# EAGLE design pokey-synth (EAGLE 6.6.0)
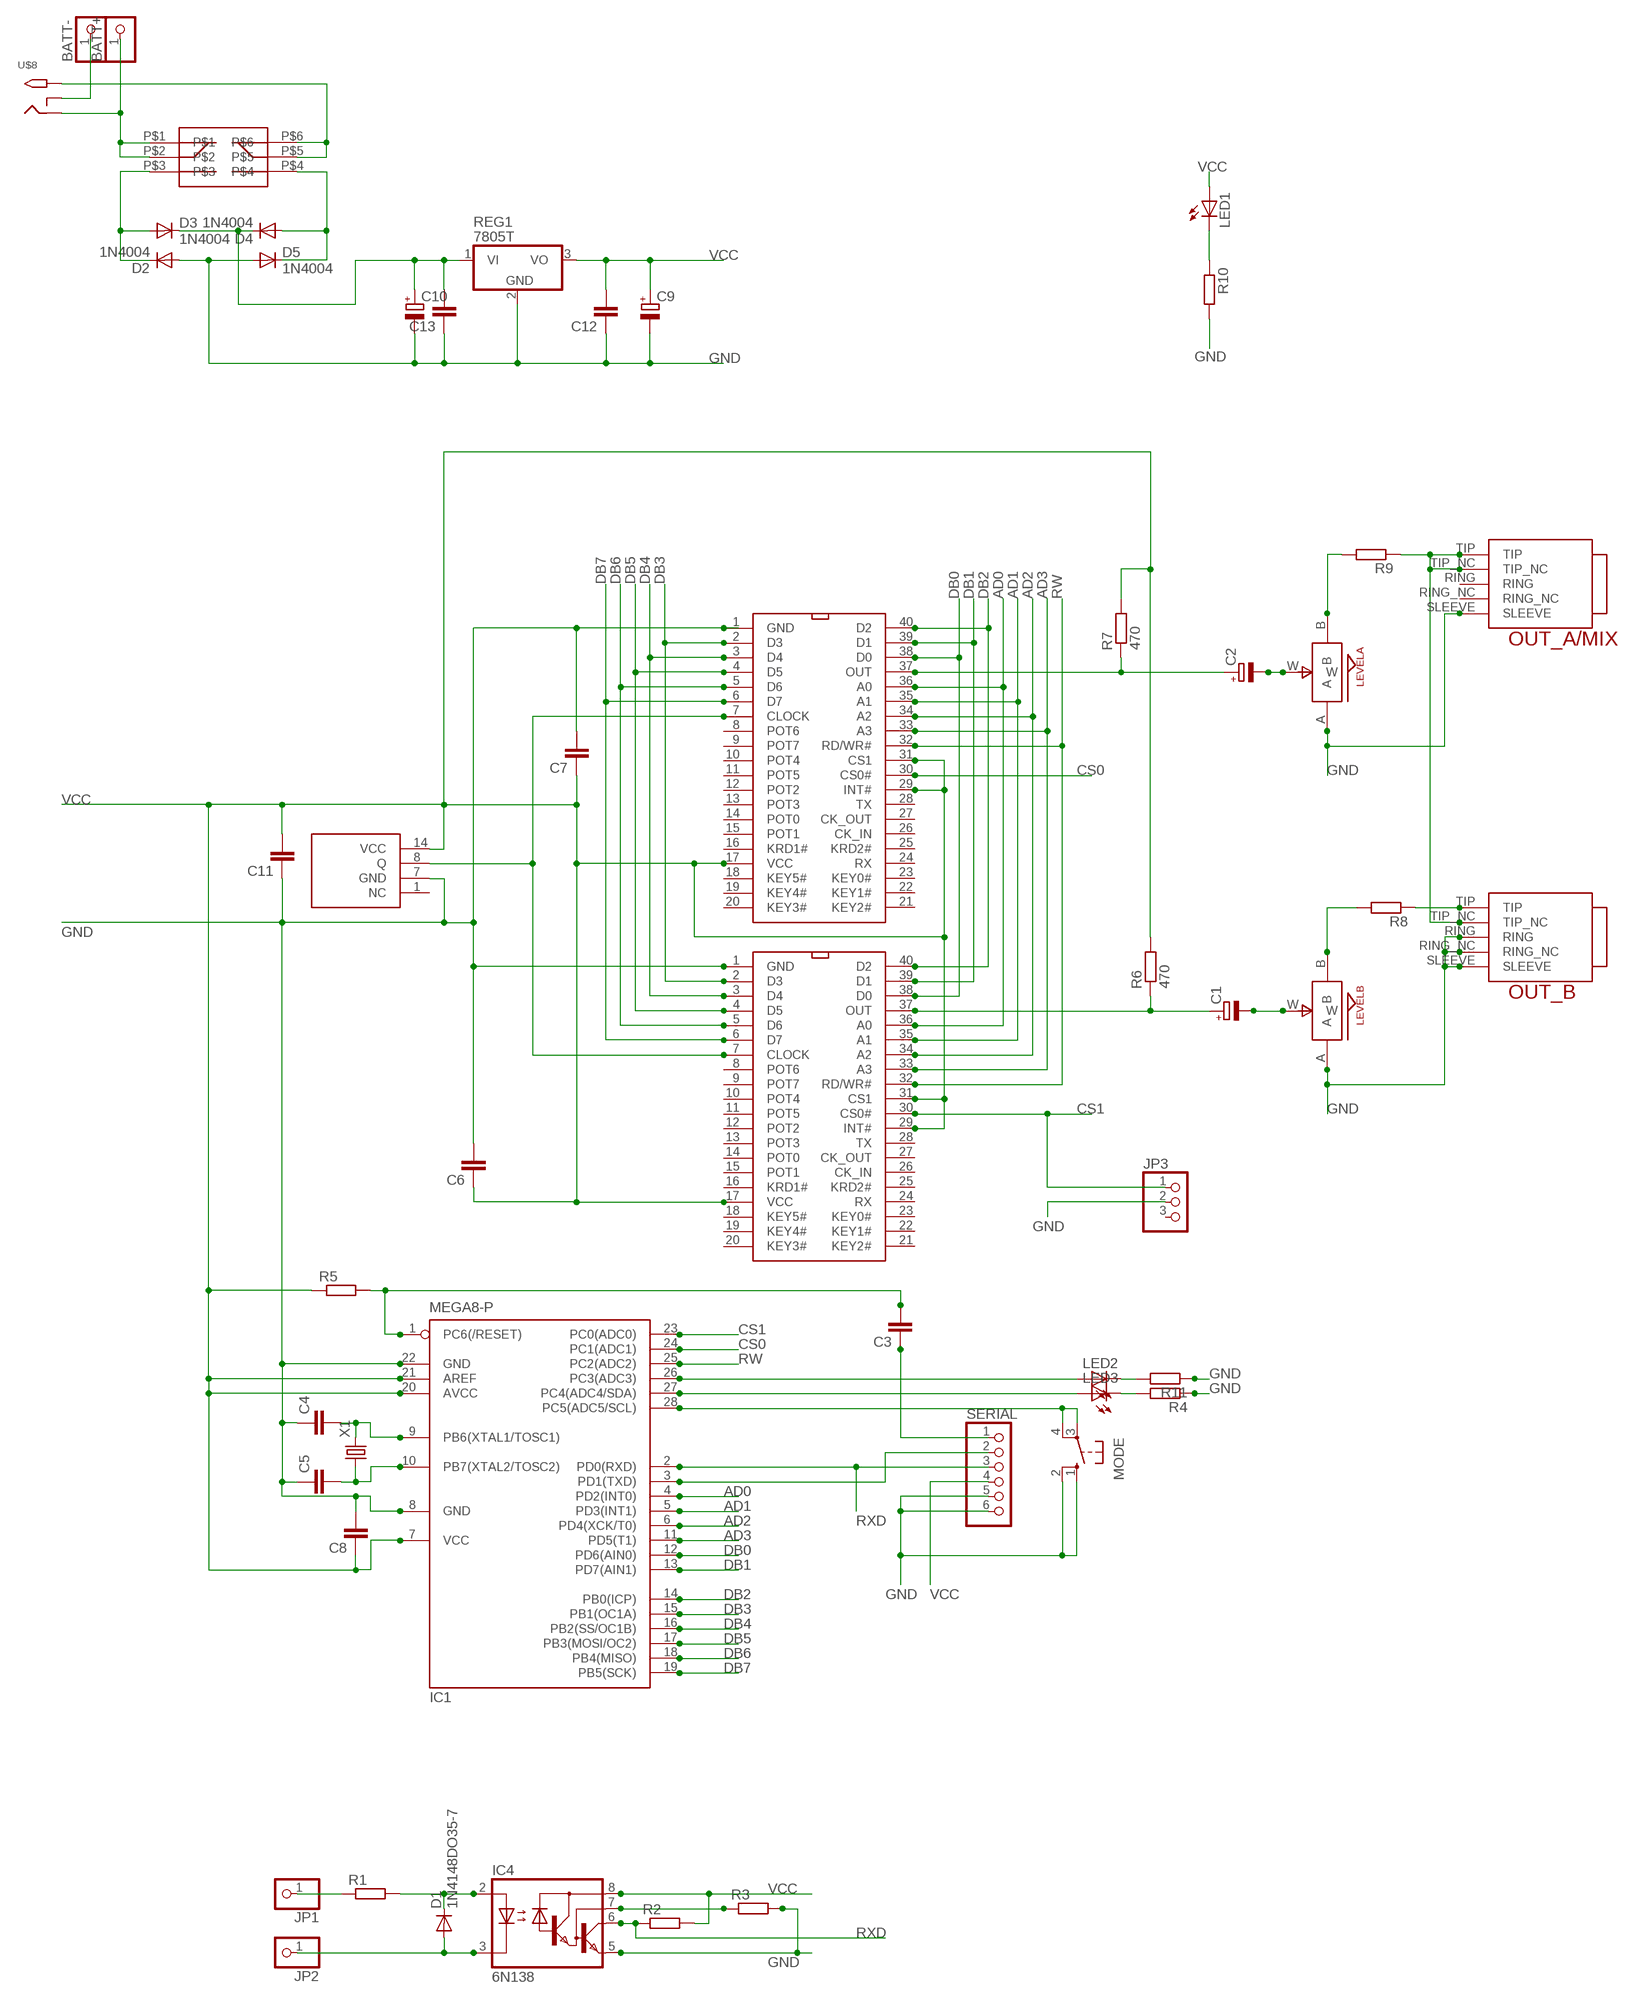
[diagram p0: schematic, sheet 1]

## Parts
BATT+  PINHD-1X1  [1X01]
BATT-  PINHD-1X1  [1X01]
C1  CPOL-EUE2-5  [E2-5]
C2  CPOL-EUE2-5  [E2-5]
C3  C-EU025-024X044  [C025-024X044]
C4  C-EU025-024X044  [C025-024X044]
C5  C-EU025-024X044  [C025-024X044]
C6  C-EU025-024X044  [C025-024X044]
C7  C-EU025-024X044  [C025-024X044]
C8  C-EU025-024X044  [C025-024X044]
C9  CPOL-EUE2-5  [E2-5]
C10  CPOL-EUE2-5  [E2-5]
C11  C-EU025-024X044  [C025-024X044]
C12  C-EU025-024X044  [C025-024X044]
C13  C-EU025-024X044  [C025-024X044]
D1  1N4148DO35-7  [DO35-7]
D2  1N4004  [DO-VERT]
D3  1N4004  [DO-VERT]
D4  1N4004  [DO-VERT]
D5  1N4004  [DO-VERT]
IC1  MEGA8-P  [DIL28-3]
IC2  POKEYDIP40  [DIL40]
IC3  POKEYDIP40  [DIL40]
IC4  6N138  [DIL08]
JP1  PINHD-1X1  [1X01]
JP2  PINHD-1X1  [1X01]
JP3  PINHD-1X3  [1X03]
LED1  LED3MM  [LED3MM]
LED2  LED3MM  [LED3MM]
LED3  LED3MM  [LED3MM]
LEVELA  ALPS_POT_SMALL  [SMALL_ALPS_POT]
LEVELB  ALPS_POT_SMALL  [SMALL_ALPS_POT]
MODE  10-XX  [B3F-10XX]
OSC1  TTLOSC  [TTLOSC]
OUT_A/MIX  TRUCONNECTJACK  [TRUCONNECTJACK]
OUT_B  TRUCONNECTJACK  [TRUCONNECTJACK]
R1  R-EU_0207/7  [0207/7]
R2  R-EU_0207/7  [0207/7]
R3  R-EU_0207/7  [0207/7]
R4  R-EU_0207/7  [0207/7]
R5  R-EU_0207/7  [0207/7]
R6  470  R-EU_0207/7  [0207/7]
R7  470  R-EU_0207/7  [0207/7]
R8  R-EU_0207/7  [0207/7]
R9  R-EU_0207/7  [0207/7]
R10  R-EU_0207/7  [0207/7]
R11  R-EU_0207/7  [0207/7]
REG1  7805T  [TO220H]
SERIAL  HEADER-1X6  [1X06_OVAL]
U$8  2.1MMJACKTHM  [PJ-102A]
U$9  2P2T_LATCHING  [2P2T_LATCHING]
X1  CRYSTALHC49U-V  [HC49U-V]

## Nets
AD0: IC1.4(PD2(INT0)) IC2.36(A0) IC3.36(A0)
AD1: IC1.5(PD3(INT1)) IC2.35(A1) IC3.35(A1)
AD2: IC1.6(PD4(XCK/T0)) IC2.34(A2) IC3.34(A2)
AD3: IC1.11(PD5(T1)) IC2.33(A3) IC3.33(A3)
CS0: IC1.24(PC1(ADC1)) IC2.30(CS0#)
CS1: IC1.23(PC0(ADC0)) IC3.30(CS0#) JP3.1
DB0: IC1.12(PD6(AIN0)) IC2.38(D0) IC3.38(D0)
DB1: IC1.13(PD7(AIN1)) IC2.39(D1) IC3.39(D1)
DB2: IC1.14(PB0(ICP)) IC2.40(D2) IC3.40(D2)
DB3: IC1.15(PB1(OC1A)) IC2.2(D3) IC3.2(D3)
DB4: IC1.16(PB2(SS/OC1B)) IC2.3(D4) IC3.3(D4)
DB5: IC1.17(PB3(MOSI/OC2)) IC2.4(D5) IC3.4(D5)
DB6: IC1.18(PB4(MISO)) IC2.5(D6) IC3.5(D6)
DB7: IC1.19(PB5(SCK)) IC2.6(D7) IC3.6(D7)
GND: C4.1 C5.1 C6.2 C7.2 C8.2 C9.- C10.- C11.1 C12.1 C13.1 D2.A D5.A IC1.8(GND) IC1.22(GND) IC2.1(GND) IC3.1(GND) IC4.5(GND) JP3.2 LEVELA.A LEVELB.A MODE.1(S) MODE.2(S1) OSC1.7(GND) OUT_A/MIX.SLEEVE OUT_B.RING OUT_B.RING_NC OUT_B.SLEEVE R3.2 R4.1 R10.2 R11.1 REG1.2(GND) SERIAL.5 SERIAL.6
N$1: C4.2 IC1.9(PB6(XTAL1/TOSC1)) X1.2
N$2: C5.2 IC1.10(PB7(XTAL2/TOSC2)) X1.1
N$3: C2.- LEVELA.W
N$4: LEVELA.B R9.2
N$5: OUT_A/MIX.TIP OUT_A/MIX.TIP_NC OUT_B.TIP_NC R9.1
N$7: C1.- LEVELB.W
N$8: JP1.1 R1.1
N$9: LEVELB.B R8.2
N$10: OUT_B.TIP R8.1
N$11: IC2.7(CLOCK) IC3.7(CLOCK) OSC1.8(Q)
N$12: C2.+ IC2.37(OUT) R7.1
N$13: C1.+ IC3.37(OUT) R6.1
N$14: D1.C IC4.2(A) R1.2
N$15: D1.A IC4.3(C) JP2.1
N$16: BATT+.1 U$8.RING U$9.P$1 U$9.P$2
N$17: IC4.7(VB) R3.1
N$18: U$8.TIP U$9.P$5 U$9.P$6
N$19: C3.2 IC1.1(PC6(/RESET)) R5.2
N$20: BATT-.1 U$8.RING_SW
N$21: C3.1 SERIAL.1
N$22: D2.C D3.A U$9.P$3
N$23: D4.A D5.C U$9.P$4
N$24: C10.+ C13.2 D3.C D4.C REG1.1(VI)
N$25: LED1.K(C) R10.1
N$26: IC1.26(PC3(ADC3)) LED2.A
N$27: LED2.K(C) R11.2
N$28: IC1.28(PC5(ADC5/SCL)) MODE.3(P) MODE.4(P1)
N$29: IC1.27(PC4(ADC4/SDA)) LED3.A
N$30: LED3.K(C) R4.2
RW: IC1.25(PC2(ADC2)) IC2.32(RD/WR#) IC3.32(RD/WR#)
RXD: IC1.2(PD0(RXD)) IC4.6(VO) R2.1 SERIAL.3
TXD: IC1.3(PD1(TXD)) SERIAL.2
VCC: C6.1 C7.1 C8.1 C9.+ C11.2 C12.2 IC1.7(VCC) IC1.20(AVCC) IC1.21(AREF) IC2.17(VCC) IC2.29(INT#) IC2.31(CS1) IC3.17(VCC) IC3.29(INT#) IC3.31(CS1) IC4.8(VCC) LED1.A OSC1.14(VCC) R2.2 R5.1 R6.2 R7.2 REG1.3(VO) SERIAL.4
Unconnected: IC2.8(POT6) IC2.9(POT7) IC2.10(POT4) IC2.11(POT5) IC2.12(POT2) IC2.13(POT3) IC2.14(POT0) IC2.15(POT1) IC2.16(KRD1#) IC2.18(KEY5#) IC2.19(KEY4#) IC2.20(KEY3#) IC2.21(KEY2#) IC2.22(KEY1#) IC2.23(KEY0#) IC2.24(RX) IC2.25(KRD2#) IC2.26(CK_IN) IC2.27(CK_OUT) IC2.28(TX) IC3.8(POT6) IC3.9(POT7) IC3.10(POT4) IC3.11(POT5) IC3.12(POT2) IC3.13(POT3) IC3.14(POT0) IC3.15(POT1) IC3.16(KRD1#) IC3.18(KEY5#) IC3.19(KEY4#) IC3.20(KEY3#) IC3.21(KEY2#) IC3.22(KEY1#) IC3.23(KEY0#) IC3.24(RX) IC3.25(KRD2#) IC3.26(CK_IN) IC3.27(CK_OUT) IC3.28(TX) JP3.3 OSC1.1(NC) OUT_A/MIX.RING OUT_A/MIX.RING_NC

## Library data of the parts
BATT+ BATT- JP1 JP2 = pinhead:PINHD-1X1: PIN HEADER
C1 C2 C9 C10 = rcl:CPOL-EU: POLARIZED CAPACITOR, European symbol
C3-C8 C11-C13 = rcl:C-EU: CAPACITOR, European symbol
D1 = diode:1N4148: DIODE high speed (Philips)
D2-D5 = jasons_stuff:1N4004: DIODE general purpose rectifier, 1 A
IC1 = atmel:MEGA8-P: MICROCONTROLLER 8 Kbytes FLASH, 1 kbytes SRAM, 512 bytes EEPROM, USART, 4-channel 10 bit ADC, 2-channel 8 bit ADC Pin compatible with Atmega48, ATMega88, ATMega168 Source: avr.lbr; OC_FARNELL: unknown; OC_NEWARK: unknown
IC2 IC3 = jasons_stuff:POKEY
IC4 = optocoupler:6N138: MOTOROLA OPTO COUPLER; MF: VISHAY/TELEFUNKEN; MPN: 6N138; OC_FARNELL: 9860150; OC_NEWARK: 35K5294
JP3 = pinhead:PINHD-1X3: PIN HEADER
LED1-LED3 = led:LED: LED OSRAM: - CHIPLED LG R971, LG N971, LY N971, LG Q971, LY Q971, LO R971, LY R971 LH N974, LH R974 LS Q976, LO Q976, LY Q976 LO Q996 - Hyper CHIPLED LW Q18S LB Q993, LB Q99A, LB R99A - SideLED LS A670, LO A670, LY A670, LG A670, LP A670 LB A673, LV A673, LT A673, LW A673 LH A674 LY A675 LS A676, LA A676, LO A676, LY A676, LW A676 LS A679, LY A679, LG A679 - Hyper Micro SIDELED® LS Y876, LA Y876, LO Y876, LY Y876 LT Y87S - SmartLED LW L88C, LW L88S LB L89C, LB L89S, LG L890 LS L89K, LO L89K, LY L89K LS L896, LA L896, LO L896, LY L896 - TOPLED LS T670, LO T670, LY T670, LG T670, LP T670 LSG T670, LSP T670, LSY T670, LOP T670, LYG T670 LG T671, LOG T671, LSG T671 LB T673, LV T673, LT T673, LW T673 LH T674 LS T676, LA T676, LO T676, LY T676, LB T676, LH T676, LSB T676, LW T676 LB T67C, LV T67C, LT T67C, LS T67K, LO T67K, LY T67K, LW E67C LS E67B, LA E67B, LO E67B, LY E67B, LB E67C, LV E67C, LT E67C LW T67C LS T679, LY T679, LG T679 LS T770, LO T770, LY T770, LG T770, LP T770 LB T773, LV T773, LT T773, LW T773 LH T774 LS E675, LA E675, LY E675, LS T675 LS T776, LA T776, LO T776, LY T776, LB T776 LHGB T686 LT T68C, LB T68C - Hyper Mini TOPLED® LB M676 - Mini TOPLED Santana® LG M470 LS M47K, LO M47K, LY M47K Source: http://www.osram.convergy.de LUXEON: - LUMILED® LXK2-PW12-R00, LXK2-PW12-S00, LXK2-PW14-U00, LXK2-PW14-V00 LXK2-PM12-R00, LXK2-PM12-S00, LXK2-PM14-U00 LXK2-PE12-Q00, LXK2-PE12-R00, LXK2-PE12-S00, LXK2-PE14-T00, LXK2-PE14-U00 LXK2-PB12-K00, LXK2-PB12-L00, LXK2-PB12-M00, LXK2-PB14-N00, LXK2-PB14-P00, LXK2-PB14-Q00 LXK2-PR12-L00, LXK2-PR12-M00, LXK2-PR14-Q00, LXK2-PR14-R00 LXK2-PD12-Q00, LXK2-PD12-R00, LXK2-PD12-S00 LXK2-PH12-R00, LXK2-PH12-S00 LXK2-PL12-P00, LXK2-PL12-Q00, LXK2-PL12-R00 Source: www.luxeon.com KINGBRIGHT: KA-3528ASYC Source: www.kingbright.com
LEVELA LEVELB = jasons_stuff:ALPS_POT_SMALL
MODE = switch-omron:10-XX: OMRON SWITCH; MPN: B3F-1000; OC_FARNELL: 176432; OC_NEWARK: 36M3542
OSC1 = jason_eagle6:TTLOSC
OUT_A/MIX OUT_B = jason_eagle6:TRUCONNECTJACK
R1-R11 = rcl:R-EU_: RESISTOR, European symbol
REG1 = linear:78*: Positive VOLTAGE REGULATOR Source: http://cache.national.com/ds/LM/LM78L05.pdf http://www.fairchildsemi.com/ds/LM/LM7805.pdf
SERIAL = microbuilder:HEADER-1X6: PIN HEADER
U$8 = adafruit:2.1MMJACK: 2.1mm x 5.5mm THM DC jack with internal switch. Digikey part #PJ-102A, 4UCON part #05537 2.1mm x 5.5mm SMT DC jack with internal switch. Digikey part #PJ-002A-SMT, 4UCON part #03267 By microbuilder.eu & adafruit.com
U$9 = jasons_stuff:2P2T_LATCHING
X1 = crystal:CRYSTAL: CRYSTAL; OC_FARNELL: 1666969; OC_NEWARK: unknown

## Board
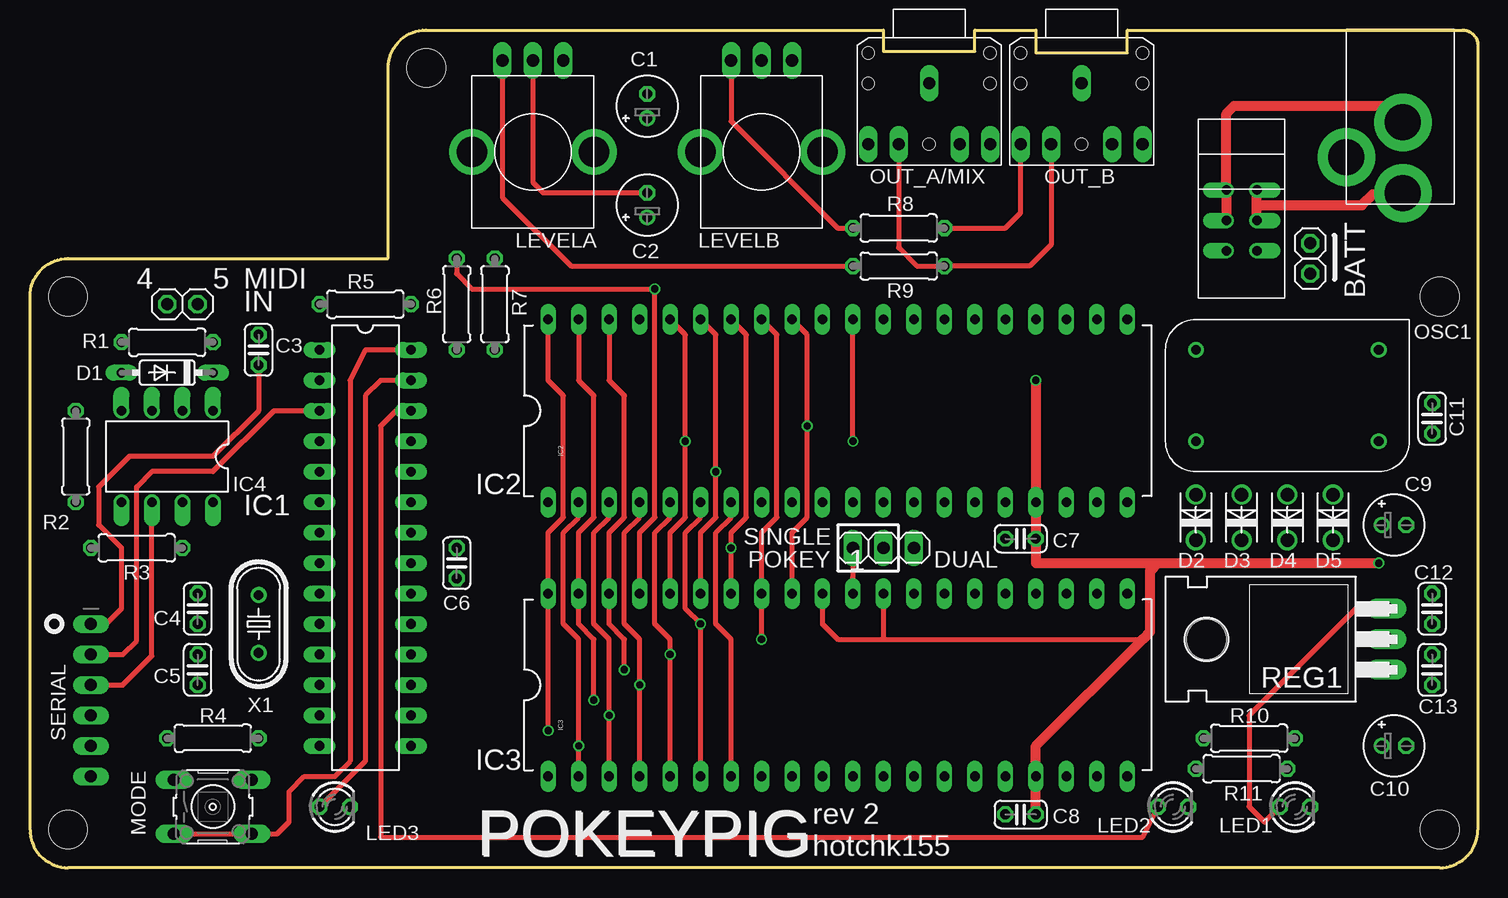
[diagram p1: board, top side]
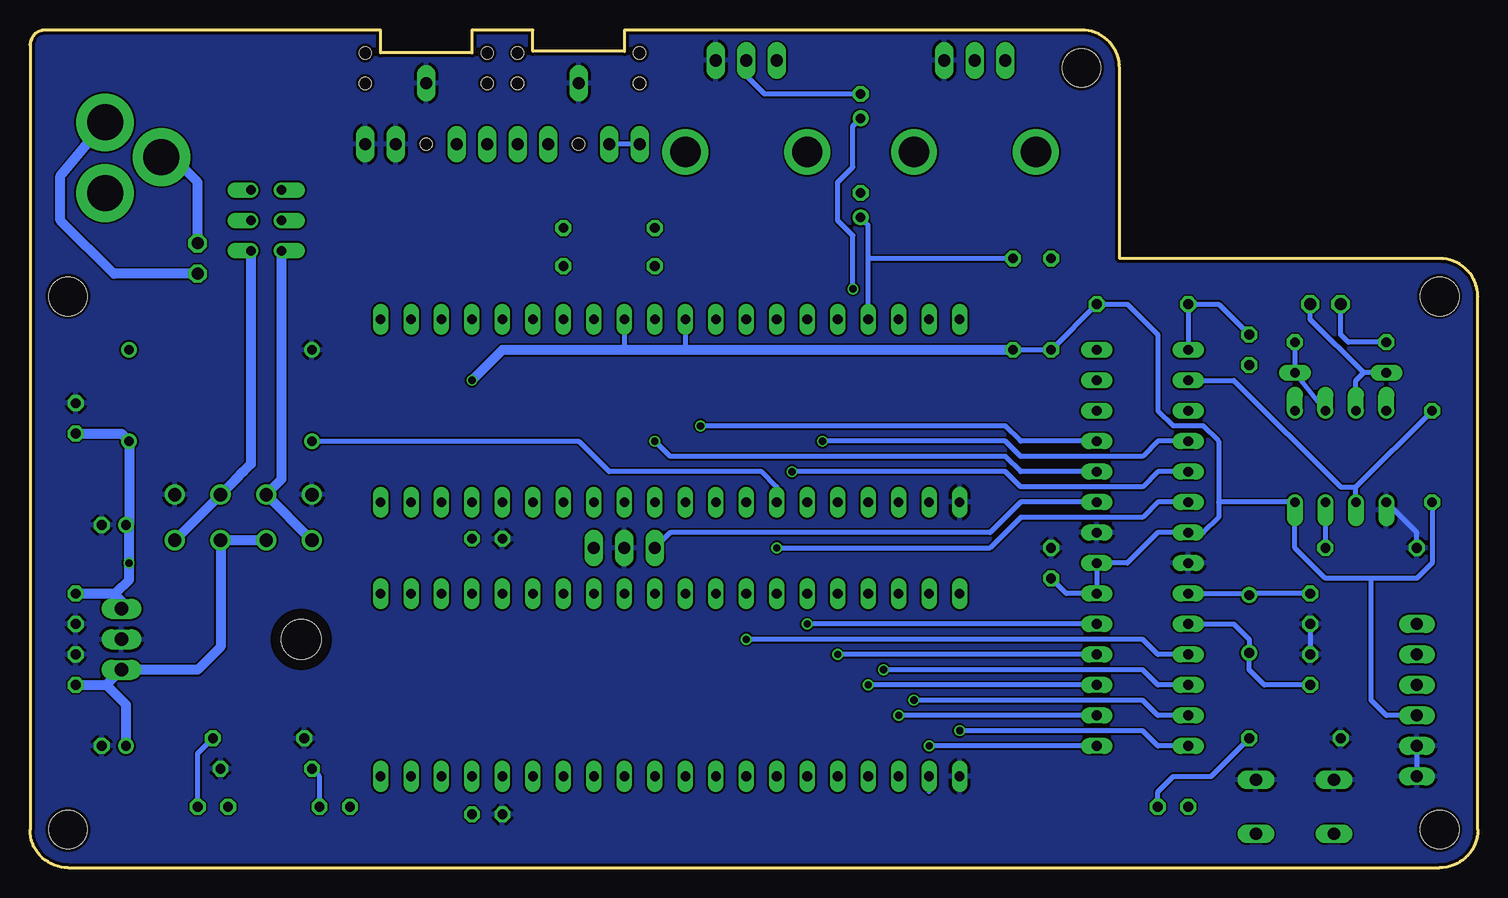
[diagram p2: board, bottom side, seen from below]

Size 120.65 x 69.85 mm. Coordinates in mm from the lower left corner, seen from the top.
Outline: 3.18,50.8 29.84,50.8 29.84,66.68 arc-90 33.02,69.85 71.12,69.85 71.12,68.07 78.74,68.07 78.74,69.85 83.82,69.85 83.82,67.94 91.44,67.94 91.44,69.85 119.38,69.85 arc-90 120.65,68.58 120.65,3.17 arc-90 117.48,0 3.18,0 arc-90 0,3.17 0,47.62 arc-90 3.18,50.8
Copper layers (1*16): Top 0.035mm / dielectric 1.5mm / Bottom 0.035mm
Design rules "ITEADstudio_DRC": minimum track width 6mil, minimum drill 12mil, track to track 6mil, track to pad 6mil, pad to pad 6mil, via to via 6mil, smd to smd 0mil, copper to edge 10mil, drill to drill 10mil, minimum pad ring 10mil, minimum via ring 6mil, stop-mask expansion 2mil, vias tented up to drill 100mil, thermal gap 10mil
Holes 3.2 mm at 33.02,66.68 3.18,3.17 117.48,3.17 3.18,47.62 117.48,47.62

### Footprints (pad centres in the part's own frame; a part is rotated, then mirrored left to right if it is on the bottom)
1X01 = drill 1.016 octagon: 1 0,0
E2-5 = drill 0.813 pad 1.27: + -1.016,0 | drill 0.813 pad 1.27 octagon: - 1.016,0
C025-024X044 = drill 0.813 octagon: 1 -1.27,0; 2 1.27,0
DO35-7 = drill 0.813 long: A 3.81,0; C -3.81,0
DO-VERT = drill 1.118: A 2.54,0; C -1.27,0
DIL28-3 = drill 0.813 long: 1 -16.51,-3.81; 2 -13.97,-3.81; 3 -11.43,-3.81; 4 -8.89,-3.81; 5 -6.35,-3.81; 6 -3.81,-3.81; 7 -1.27,-3.81; 8 1.27,-3.81; 9 3.81,-3.81; 10 6.35,-3.81; 11 8.89,-3.81; 12 11.43,-3.81; 13 13.97,-3.81; 14 16.51,-3.81; 15 16.51,3.81; 16 13.97,3.81; 17 11.43,3.81; 18 8.89,3.81; 19 6.35,3.81; 20 3.81,3.81; 21 1.27,3.81; 22 -1.27,3.81; 23 -3.81,3.81; 24 -6.35,3.81; 25 -8.89,3.81; 26 -11.43,3.81; 27 -13.97,3.81; 28 -16.51,3.81
DIL40 = drill 0.8 long: 1 -24.13,-7.62; 2 -21.59,-7.62; 3 -19.05,-7.62; 4 -16.51,-7.62; 5 -13.97,-7.62; 6 -11.43,-7.62; 7 -8.89,-7.62; 8 -6.35,-7.62; 9 -3.81,-7.62; 10 -1.27,-7.62; 11 1.27,-7.62; 12 3.81,-7.62; 13 6.35,-7.62; 14 8.89,-7.62; 15 11.43,-7.62; 16 13.97,-7.62; 17 16.51,-7.62; 18 19.05,-7.62; 19 21.59,-7.62; 20 24.13,-7.62; 21 24.13,7.62; 22 21.59,7.62; 23 19.05,7.62; 24 16.51,7.62; 25 13.97,7.62; 26 11.43,7.62; 27 8.89,7.62; 28 6.35,7.62; 29 3.81,7.62; 30 1.27,7.62; 31 -1.27,7.62; 32 -3.81,7.62; 33 -6.35,7.62; 34 -8.89,7.62; 35 -11.43,7.62; 36 -13.97,7.62; 37 -16.51,7.62; 38 -19.05,7.62; 39 -21.59,7.62; 40 -24.13,7.62
DIL08 = drill 0.813 offset: 1 -3.81,-3.81; 2 -1.27,-3.81; 3 1.27,-3.81; 4 3.81,-3.81; 5 3.81,3.81; 6 1.27,3.81; 7 -1.27,3.81; 8 -3.81,3.81
1X03 = drill 1.016 long: 1 -2.54,0; 2 0,0; 3 2.54,0
LED3MM = drill 0.813 octagon: A -1.27,0; K 1.27,0
SMALL_ALPS_POT = drill 1.016 long: A -2.54,-7.62; B 2.54,-7.62; W 0,-7.62 | drill 2.54 pad 3.81: GND@1 -5.08,0; GND@2 5.08,0
B3F-10XX = drill 1.016 long: 1 -3.251,2.261; 2 3.251,2.261; 3 -3.251,-2.261; 4 3.251,-2.261
TTLOSC = drill 0.8: 1 -7.62,-2.54; 7 7.62,-2.54; 8 7.62,5.08; 14 -7.62,5.08
TRUCONNECTJACK = drill 1.016 long: RING -1.27,-5.08; RING_NC -1.27,-2.54; SLEEVE 3.81,0; TIP -1.27,5.08; TIP_NC -1.27,2.54 | hole 1.016: 3.81,5.08; 6.35,5.08; 3.81,-5.08; 6.35,-5.08; -1.27,0
0207/7 = drill 0.813 octagon: 1 -3.81,0; 2 3.81,0
TO220H = drill 1.118 long: 1 -2.54,-10.16; 2 0,-10.16; 3 2.54,-10.16 | hole 3.302: 0,4.826
1X06_OVAL = drill 1 long: 1 -6.35,0; 2 -3.81,0; 3 -1.27,0; 4 1.27,0; 5 3.81,0; 6 6.35,0
PJ-102A = drill 3 pad 4.8: RING 0.1,-3.39; RING_SW -4.6,-6.29; TIP 0.1,-9.29
2P2T_LATCHING = drill 0.8 offset: P$1 -1.27,0; P$2 -1.27,-2.54; P$3 -1.27,-5.08; P$4 1.27,-5.08; P$5 1.27,-2.54; P$6 1.27,0
HC49U-V = drill 0.813: 1 -2.413,0; 2 2.413,0

### Placement (x,y rotation side)
BATT+  106.68,49.53 0 top
BATT-  106.68,52.07 0 top
C1  51.44,63.5 90 top
C2  51.44,55.24 90 top
C3  19.05,43.18 90 top
C4  13.97,21.59 90 top
C5  13.97,16.51 270 top
C6  35.56,25.4 90 top
C7  82.55,27.43 180 top
C8  82.55,4.45 180 top
C9  113.67,28.57 0 top
C10  113.67,10.16 0 top
C11  116.84,37.46 270 top
C12  116.84,21.59 90 top
C13  116.84,16.51 270 top
D1  11.43,41.27 180 top
D2  97.16,28.57 90 top
D3  100.97,28.57 90 top
D4  104.78,28.57 90 top
D5  108.59,28.57 90 top
IC1  27.94,26.67 270 top
IC2  67.31,38.1 0 top
IC3  67.31,15.24 0 top
IC4  11.43,34.29 180 top
JP1  11.43,46.99 0 top
JP2  13.97,46.99 0 top
JP3  71.12,26.67 0 top
LED1  105.41,5.08 0 top
LED2  95.25,5.08 0 top
LED3  25.4,5.08 0 top
LEVELA  41.91,59.69 180 top
LEVELB  60.96,59.69 180 top
MODE  15.24,5.08 0 top
OSC1  104.78,40.64 180 top
OUT_A/MIX  74.93,61.6 90 top
OUT_B  87.63,61.6 90 top
R1  11.43,43.82 0 top
R2  3.81,34.29 270 top
R3  8.89,26.67 180 top
R4  15.24,10.8 0 top
R5  27.94,46.99 180 top
R6  35.56,46.99 270 top
R7  38.73,46.99 270 top
R8  72.39,53.34 180 top
R9  72.39,50.16 180 top
R10  101.6,10.8 180 top
R11  100.97,8.26 180 top
REG1  102.87,19.05 90 top
SERIAL  5.08,13.97 270 top
U$8  114.3,65.53 0 top
U$9  100.97,56.51 0 top
X1  19.05,20.32 90 top

### Tracks (layer width: path | path; a pad name or v marks a point on that pad's centre or on a via)
AD0  (via drill 0.6)
  Top 0.406: IC3.36 53.34,27.94 54.61,29.21 v54.61,35.56 54.61,44.45 IC2.36
  Bottom 0.406: v54.61,35.56 39.37,35.56 38.1,34.29 27.94,34.29 26.67,35.56 IC1.4
AD1  (via drill 0.6)
  Top 0.406: IC3.35 55.88,27.94 57.15,29.21 v57.15,33.02 57.15,44.45 IC2.35
  Bottom 0.406: v57.15,33.02 39.37,33.02 38.1,31.75 27.94,31.75 26.67,33.02 IC1.5
AD2  (via drill 0.6)
  Top 0.406: IC3.34 v58.42,26.67 58.42,27.94 59.69,29.21 59.69,44.45 IC2.34
  Bottom 0.406: v58.42,26.67 40.64,26.67 38.1,29.21 27.94,29.21 26.67,30.48 IC1.6
AD3  (via drill 0.6)
  Top 0.406: IC2.33 62.23,44.45 62.23,29.21 60.96,27.94 IC3.33 v60.96,19.05
  Bottom 0.406: IC1.11 26.67,17.78 27.94,19.05 v60.96,19.05
CS0  (via drill 0.6)
  Top 0.406: v68.58,35.56 IC2.30
  Bottom 0.406: IC1.24 38.1,33.02 39.37,34.29 67.31,34.29 v68.58,35.56
CS1
  Top 0.406: 68.58,24.26 IC3.30 JP3.1
  Bottom 0.406: IC1.23 38.1,30.48 40.64,27.94 67.31,27.94 JP3.1
DB0  (via drill 0.6)
  Top 0.406: v49.53,16.51 49.53,19.05 48.26,20.32 IC3.38 48.26,27.94 49.53,29.21 49.53,39.37 48.26,40.64 IC2.38
  Bottom 0.406: IC1.12 26.67,15.24 27.94,16.51 v49.53,16.51
DB1  (via drill 0.6)
  Top 0.406: v46.99,13.97 46.99,19.05 45.72,20.32 IC3.39 45.72,27.94 46.99,29.21 46.99,39.37 45.72,40.64 IC2.39
  Bottom 0.406: IC1.13 26.67,12.7 27.94,13.97 v46.99,13.97
DB2  (via drill 0.6)
  Top 0.406: v43.18,11.43 IC3.40 43.18,27.94 44.45,29.21 44.45,39.37 43.18,40.64 IC2.40
  Bottom 0.406: IC1.14 26.67,10.16 27.94,11.43 v43.18,11.43
DB3  (via drill 0.6)
  Top 0.406: IC3.2 v45.72,10.16 45.72,13.97 45.72,19.05 44.45,20.32 44.45,27.94 45.72,29.21 IC2.2
  Bottom 0.406: 45.72,6.35 IC3.2 | IC1.15 v45.72,10.16
DB4  (via drill 0.6)
  Top 0.406: IC3.3 v48.26,12.7 48.26,19.05 46.99,20.32 46.99,27.94 48.26,29.21 IC2.3
  Bottom 0.406: IC1.16 v48.26,12.7
DB5  (via drill 0.6)
  Top 0.406: IC3.4 v50.8,15.24 50.8,19.05 49.53,20.32 49.53,27.94 50.8,29.21 IC2.4
  Bottom 0.406: IC1.17 v50.8,15.24
DB6  (via drill 0.6)
  Top 0.406: IC3.5 v53.34,17.78 53.34,19.05 52.07,20.32 52.07,27.94 53.34,29.21 IC2.5
  Bottom 0.406: IC1.18 v53.34,17.78
DB7  (via drill 0.6)
  Top 0.406: IC3.6 v55.88,20.32 54.61,21.59 54.61,27.94 55.88,29.21 IC2.6
  Bottom 0.406: IC1.19 v55.88,20.32
GND
  Bottom 0.406: R3.2 5.08,27.94 IC4.5 | C4.1 C5.1 | SERIAL.5 SERIAL.6
  pour Bottom: -5.08,77.47 -5.08,-2.54 124.46,-2.54 124.46,77.47
N$1
  Bottom 0.406: IC1.9 19.18,22.86 X1.2 18.92,22.86 C4.2
N$2
  Bottom 0.406: IC1.10 20.32,20.32 19.05,19.05 X1.1 19.05,16.51 17.78,15.24 C5.2
N$3
  Top 0.406: LEVELA.W 41.91,57.15 42.8,56.26 C2.-
N$4
  Top 0.406: LEVELA.B 39.37,55.88 45.09,50.16 R9.2
N$5
  Top 0.406: OUT_A/MIX.TIP_NC 72.39,51.69 73.91,50.16 R9.1 83.31,50.16 85.09,51.94 OUT_B.TIP_NC
  Bottom 0.406: OUT_A/MIX.TIP OUT_A/MIX.TIP_NC
N$7
  Bottom 0.406: C1.- 59.44,64.52 60.96,66.04 LEVELB.W
N$8
  Bottom 0.406: R1.1 10.79,43.82 11.43,44.45 JP1.1
N$9
  Top 0.406: LEVELB.B 58.42,62.23 67.31,53.34 R8.2
N$10
  Top 0.406: R8.1 81.28,53.34 82.55,54.61 OUT_B.TIP
N$11
  Top 0.406: IC3.7 58.42,19.05 57.15,20.32 57.15,27.94 58.42,29.21 IC2.7
  Bottom 0.406: IC2.7 58.42,31.75 59.69,33.02 72.39,33.02 74.93,35.56 OSC1.8
N$12
  Bottom 0.406: IC2.37 50.8,50.8 | 50.8,50.8 50.8,53.59 C2.+ | R7.1 50.8,50.8
N$13  (via drill 0.6)
  Top 0.406: IC3.37 50.8,27.94 52.07,29.21 v52.07,48.26 36.83,48.26 35.56,49.53 R6.1
  Bottom 0.406: v52.07,48.26 52.07,52.71 53.34,53.98 53.34,57.15 52.07,58.42 52.07,61.85 C1.+
N$14
  Bottom 0.406: R1.2 D1.C IC4.2
N$15
  Bottom 0.406: D1.A 9.53,41.27 | 9.53,41.27 13.97,45.72 JP2.1 | IC4.3 10.16,40.64 9.53,41.27
N$16
  Top 0.813: U$9.P$2 U$9.P$1 99.7,62.87 100.33,63.5 113.03,63.5 U$8.RING
  Bottom 0.813: BATT+.1 113.67,49.53 118.11,53.98 118.11,57.67 U$8.RING
N$17
  Bottom 0.406: IC4.7 R3.1
N$18
  Top 0.813: 102.23,55.24 U$9.P$6 | U$9.P$5 102.23,55.24 | 102.23,55.24 111,55.24 111.89,56.13 114.29,56.13 U$8.TIP
N$19
  Bottom 0.406: IC1.1 R5.2 21.59,46.99 C3.2
N$20
  Bottom 0.813: BATT-.1 106.68,57.15 108.77,59.24 U$8.RING_SW
N$21
  Top 0.406: SERIAL.1 6.35,20.32 7.62,21.59 7.62,26.67 5.71,28.57 5.71,31.75 8.26,34.29 15.24,34.29 19.05,38.1 C3.1
N$22
  Bottom 0.813: D2.C D3.A 99.7,32.38 U$9.P$3
N$23
  Bottom 0.813: D5.C D4.A 103.5,32.38 102.87,33.02 102.23,33.66 U$9.P$4
N$24
  Bottom 0.813: D3.C D4.C 104.78,18.41 106.68,16.51 REG1.1 114.3,15.24 | C13.2 114.3,15.24 | C10.+ 112.65,13.59 114.3,15.24
N$25
  Bottom 0.406: LED1.K 106.68,9.52 R10.1
N$26
  Top 0.406: LED2.A 92.71,2.54 29.21,2.54 29.21,36.83 30.48,38.1 IC1.26
N$27
  Bottom 0.406: LED2.K 96.52,7.62 R11.2
N$28
  Top 0.406: IC1.28 27.94,43.18 26.67,40.64 26.67,8.89 25.4,7.62 22.86,7.62 21.59,6.35 21.59,3.81 20.6,2.82 MODE.4 MODE.3
N$29
  Top 0.406: IC1.27 29.21,40.64 27.94,39.37 27.94,8.89 LED3.A
N$30
  Bottom 0.406: LED3.K 26.67,6.35 25.4,7.62 22.23,7.62 R4.2
RW  (via drill 0.6)
  Top 0.406: IC3.32 63.5,27.94 64.77,29.21 v64.77,36.83 64.77,44.45 IC2.32
  Bottom 0.406: IC1.25 38.1,35.56 39.37,36.83 v64.77,36.83
RXD
  Top 0.406: SERIAL.3 7.75,15.24 10.16,17.65 IC4.6
  Bottom 0.406: IC4.6 10.16,31.75 | 10.16,31.75 R2.1 | IC1.2 20.32,40.64 11.43,31.75 10.16,31.75
TXD
  Top 0.406: SERIAL.2 7.75,17.78 8.89,18.92 8.89,31.75 10.16,33.02 15.24,33.02 20.32,38.1 IC1.3
VCC  (via drill 0.6)
  Top 0.406: LED1.A 102.87,3.81 101.6,5.08 101.6,12.7 110.49,21.59 REG1.3 | IC3.31 66.04,20.32 67.31,19.05 71.12,19.05 | 71.12,19.05 92.71,19.05 | IC3.29 71.12,19.05
  Top 0.813: 93.98,25.4 v112.39,25.4 | C8.1 IC3.17 83.82,10.16 92.71,19.05 93.34,19.69 93.34,24.77 93.98,25.4 | v83.82,40.64 IC2.17 C7.1 83.82,25.4 93.98,25.4
  Bottom 0.406: R2.2 3.81,25.4 5.08,24.13 8.89,24.13 | 21.59,30.48 21.59,35.56 22.86,36.83 25.4,36.83 26.67,38.1 26.67,44.45 29.21,46.99 R5.1 R6.2 R7.2 | IC2.31 66.04,43.18 | IC2.29 71.12,43.18 | 21.59,30.48 IC4.8 15.24,26.67 12.7,24.13 8.89,24.13 | SERIAL.4 7.62,12.7 8.89,13.97 8.89,24.13 | 21.59,30.48 21.59,29.21 22.86,27.94 IC1.7 26.67,27.94 29.21,25.4 IC1.21 IC1.20 34.29,22.86 C6.1
  Bottom 0.813: R7.2 66.04,43.18 71.12,43.18 81.28,43.18 v83.82,40.64 | 112.39,28.57 OSC1.14 113.03,36.2 C11.2 | C9.+ 112.39,28.57 | 112.39,28.57 v112.39,25.4 112.39,24 113.54,22.86 113.67,22.86 | C12.2 113.67,22.86 | REG1.3 113.03,22.23 113.67,22.86

### Text on the board
tPlace: BATT | 4 | 5 | MIDI | IN | IC2 | SINGLE | POKEY | 1 | DUAL | IC3
tNames: rev 2 | POKEYPIG | POKEYPIG | hotchk155